# Altium schematic sheet Controller_PCB_OPAMP.SchDoc
size A4
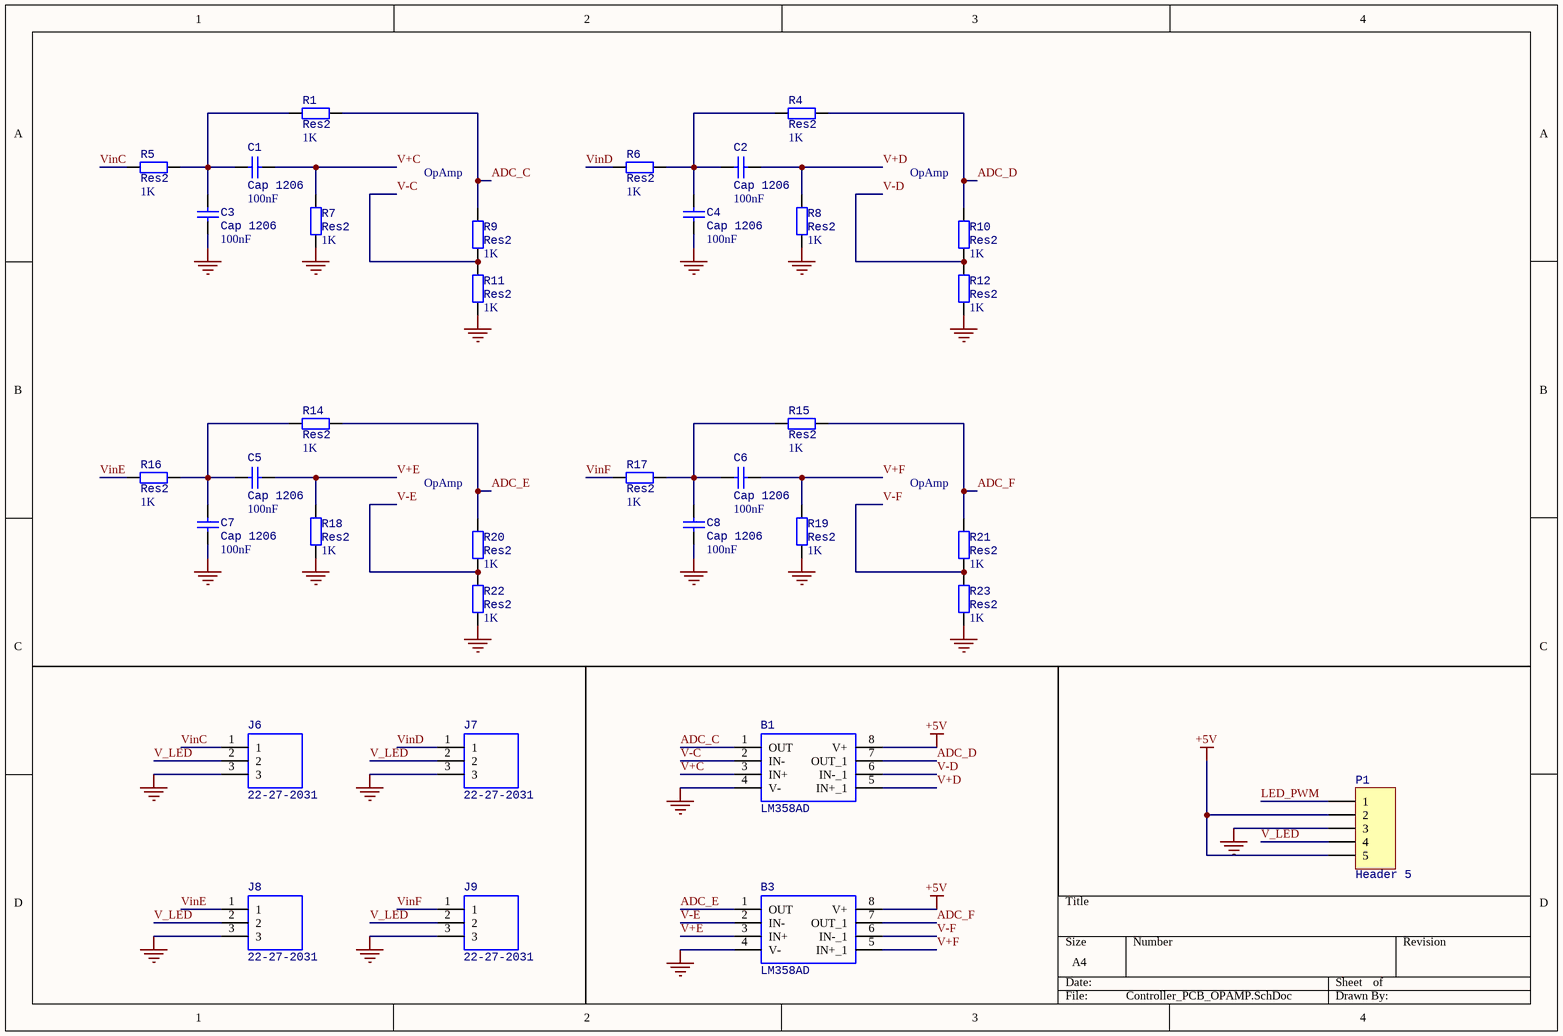
[diagram p0: Controller_PCB_OPAMP.SchDoc]

## Parts
B1  LM358AD  [SOIC127P600X175-8N]
B3  LM358AD  [SOIC127P600X175-8N]
C1  Cap 1206  value 100nF  [C1206]
C2  Cap 1206  value 100nF  [C1206]
C3  Cap 1206  value 100nF  [C1206]
C4  Cap 1206  value 100nF  [C1206]
C5  Cap 1206  value 100nF  [C1206]
C6  Cap 1206  value 100nF  [C1206]
C7  Cap 1206  value 100nF  [C1206]
C8  Cap 1206  value 100nF  [C1206]
J6  22-27-2031  [SHDR3W64P0X254_1X3_762X580X1170P]
J7  22-27-2031  [SHDR3W64P0X254_1X3_762X580X1170P]
J8  22-27-2031  [SHDR3W64P0X254_1X3_762X580X1170P]
J9  22-27-2031  [SHDR3W64P0X254_1X3_762X580X1170P]
P1  Header 5  [SOT353-1]
R1  Res2  value 1K  [C1206]
R4  Res2  value 1K  [C1206]
R5  Res2  value 1K  [C1206]
R6  Res2  value 1K  [C1206]
R7  Res2  value 1K  [C1206]
R8  Res2  value 1K  [C1206]
R9  Res2  value 1K  [C1206]
R10  Res2  value 1K  [C1206]
R11  Res2  value 1K  [C1206]
R12  Res2  value 1K  [C1206]
R14  Res2  value 1K  [C1206]
R15  Res2  value 1K  [C1206]
R16  Res2  value 1K  [C1206]
R17  Res2  value 1K  [C1206]
R18  Res2  value 1K  [C1206]
R19  Res2  value 1K  [C1206]
R20  Res2  value 1K  [C1206]
R21  Res2  value 1K  [C1206]
R22  Res2  value 1K  [C1206]
R23  Res2  value 1K  [C1206]

## Nets
+5V: B1.8(V+) B3.8(V+) P1.2 P1.5
GND: B1.4(V-) B3.4(V-) C3.1 C4.1 C7.1 C8.1 J6.3 J7.3 J8.3 J9.3 P1.3 R7.1 R8.1 R11.1 R12.1 R18.1 R19.1 R22.1 R23.1
ADC_C: B1.1(OUT) R1.2 R9.2
ADC_D: B1.7(OUT_1) R4.2 R10.2
ADC_E: B3.1(OUT) R14.2 R20.2
ADC_F: B3.7(OUT_1) R15.2 R21.2
LED_PWM: P1.1
V+C: B1.3(IN+) C1.1 R7.2
V+D: B1.5(IN+_1) C2.1 R8.2
V+E: B3.3(IN+) C5.1 R18.2
V+F: B3.5(IN+_1) C6.1 R19.2
V-C: B1.2(IN-) R9.1 R11.2
V-D: B1.6(IN-_1) R10.1 R12.2
V-E: B3.2(IN-) R20.1 R22.2
V-F: B3.6(IN-_1) R21.1 R23.2
V_LED: J6.2 J7.2 J8.2 J9.2 P1.4
VinC: J6.1 R5.1
VinD: J7.1 R6.1
VinE: J8.1 R16.1
VinF: J9.1 R17.1
NetC1_2: C1.2 C3.2 R1.1 R5.2
NetC2_2: C2.2 C4.2 R4.1 R6.2
NetC5_2: C5.2 C7.2 R14.1 R16.2
NetC6_2: C6.2 C8.2 R15.1 R17.2

## Notes on the sheet
- (near R9) OpAmp
- (near R10) OpAmp
- (near R20) OpAmp
- (near R21) OpAmp

## Library data of the parts
B1 B3 = LM358AD: LM358AD, Dual Operational Amplifier 1.1MHz 5 to 28V, 8-Pin SO; Manufacturer_Name: STMicroelectronics; Geometry.Height: 1.75mm; RS Part Number: 1657542; Manufacturer_Part_Number: LM358AD; Datasheet Link: http://uk.rs-online.com/web/p/products/1657542
C1-C8 = Cap Semi: Capacitor (Semiconductor SIM Model); Published: 8-Jun-2000; LatestRevisionDate: 29-May-2009; LatestRevisionNote: IPC-7351 Footprint Added.; PackageReference: C1206; Publisher: Altium Limited; PackageDescription: Chip Capacitor
J6-J9 = 22-27-2031: 3way straight PCB header w/friction lock Molex KK Series, Series Number 6410, 2.54mm Pitch 3 Way 1 Row Straight PCB Header, Solder Termination, 4A; Allied_Number: 70190935; Geometry.Height: 11.7mm; RS Part Number: 1707102; Manufacturer_Name: Molex; Manufacturer_Part_Number: 22-27-2031; Datasheet Link: http://uk.rs-online.com/web/p/products/1707102
P1 = Header 5: Header, 5-Pin; LatestRevisionDate: 17-Jul-2002; LatestRevisionNote: Re-released for DXP Platform.; Publisher: Altium Limited
R1 R4-R12 R14-R23 = Res2: Resistor; Published: 8-Jun-2000; LatestRevisionDate: 17-Jul-2002; LatestRevisionNote: Re-released for DXP Platform.; PackageReference: AXIAL-0.4; Publisher: Altium Limited; PackageDescription: Axial Device, Thru-Hole; 2 Leads; 0.4 in Pin Spacing